# Altium schematic sheet SWITCH.SchDoc
size A4; SheetNumber: 5; SheetTotal: 6
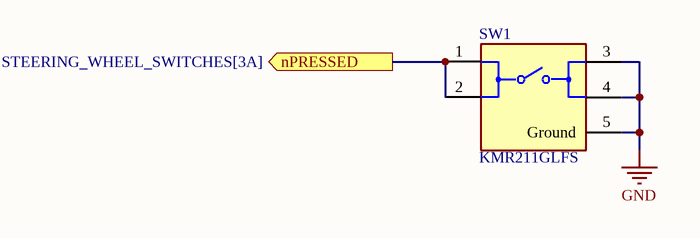
[diagram p0: SWITCH.SchDoc]

## Parts
SW1  KMR211GLFS  [FP-KMR211GLFS-MFG]

## Ports
nPRESSED (out, see STEERING_WHEEL_SWITCHES[3A])

## Nets
GND: SW1.3 SW1.4 SW1.5(Ground)
nPRESSED: SW1.1 SW1.2 ; port nPRESSED

## Library data of the parts
SW1 = CMP-10040-000023-1: SWITCH TACTILE SPST-NO 0.05A 32V; Switch Function: Off-Mom; Throw Configuration: SPST; Switch Travel: 0.2mm; Current Rating: 50mA; Illumination Type: Non-Illuminated; Actuator Length: 0.5mm; Power Rating: 1W; Operating Force: 1.2N; Actuator Type: Standard; Mechanical Life: 200000Cycles; REACH SVHC: No SVHC; Voltage Rating (DC): 32V; Length: 2.8mm; Min Operating Temperature: -40°C; Mount: Surface Mount; Max Voltage Rating (DC): 32V; Width: 2.8mm; Depth: 4.6mm; Packaging: Tape and Reel; Lead Free: Lead Free; Contact Material: Silver; Termination: Gull Wing; Package Quantity: 1; Contact Current Rating: 50mA; Orientation: Straight; Max Operating Temperature: 85°C; Radiation Hardening: No; Max Current Rating: 50mA; Contact Plating: Silver